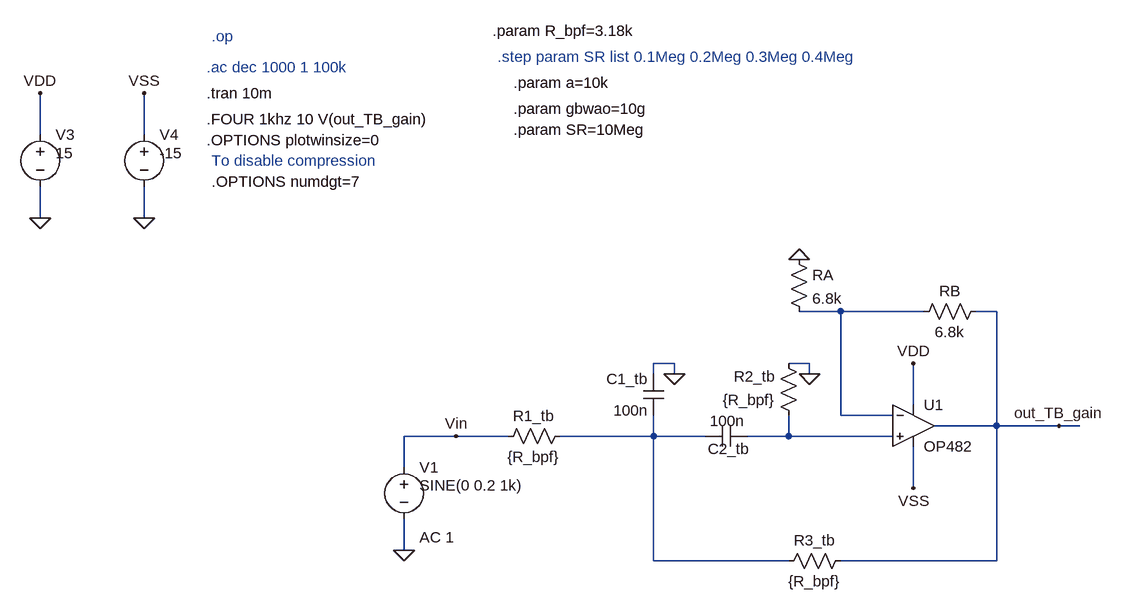
[diagram p0: schematic Etaj 2 - FTB.asc]
Etaj 2 - FTB.asc, the LTspice schematic file:
Version 4.1
SHEET 1 2932 1708
WIRE 1088 -16 1088 -80
WIRE 1248 -16 1248 -80
WIRE 1088 112 1088 64
WIRE 1248 112 1248 64
WIRE 2320 256 2256 256
WIRE 2448 256 2320 256
WIRE 2560 256 2528 256
WIRE 2064 336 2032 336
WIRE 2272 336 2240 336
WIRE 2032 352 2032 336
WIRE 2064 352 2064 336
WIRE 2272 352 2272 336
WIRE 2432 400 2432 336
WIRE 2320 416 2320 256
WIRE 2400 416 2320 416
WIRE 2560 432 2560 256
WIRE 2560 432 2464 432
WIRE 2656 432 2560 432
WIRE 2688 432 2656 432
WIRE 1728 448 1648 448
WIRE 1808 448 1728 448
WIRE 2032 448 2032 416
WIRE 2032 448 1888 448
WIRE 2112 448 2032 448
WIRE 2240 448 2240 416
WIRE 2240 448 2176 448
WIRE 2400 448 2240 448
WIRE 1648 496 1648 448
WIRE 2432 528 2432 464
WIRE 1648 624 1648 576
WIRE 2032 640 2032 448
WIRE 2240 640 2032 640
WIRE 2560 640 2560 432
WIRE 2560 640 2320 640
FLAG 1088 112 0
FLAG 1248 112 0
FLAG 1088 -80 VDD
FLAG 1248 -80 VSS
FLAG 1648 624 0
FLAG 2656 432 out_TB_gain
FLAG 2432 528 VSS
FLAG 2432 336 VDD
FLAG 1728 448 Vin
FLAG 2064 352 0
FLAG 2256 176 0
FLAG 2272 352 0
DATAFLAG 2528 432 ""
SYMBOL voltage 1088 -32 R0
WINDOW 123 24 124 Left 2
WINDOW 39 0 0 Left 2
WINDOW 3 24 44 Left 2
SYMATTR Value 15
SYMATTR InstName V3
SYMBOL voltage 1248 -32 R0
WINDOW 123 24 124 Left 2
WINDOW 39 0 0 Left 2
WINDOW 3 24 44 Left 2
SYMATTR Value -15
SYMATTR InstName V4
SYMBOL voltage 1648 480 R0
WINDOW 123 24 124 Left 2
WINDOW 39 0 0 Left 2
WINDOW 3 24 44 Left 2
SYMATTR Value2 AC 1
SYMATTR Value SINE(0 0.2 1k)
SYMATTR InstName V1
SYMBOL cap 2048 352 M0
SYMATTR InstName C1_tb
SYMATTR Value 100n
SYMBOL res 1904 432 R90
WINDOW 0 0 56 VBottom 2
WINDOW 3 32 56 VTop 2
SYMATTR InstName R1_tb
SYMATTR Value {R_bpf}
SYMBOL res 2256 432 R180
WINDOW 0 36 76 Left 2
WINDOW 3 36 40 Left 2
SYMATTR InstName R2_tb
SYMATTR Value {R_bpf}
SYMBOL cap 2112 464 R270
WINDOW 0 -19 36 VTop 2
WINDOW 3 55 34 VBottom 2
SYMATTR InstName C2_tb
SYMATTR Value 100n
SYMBOL res 2336 624 R90
WINDOW 0 0 56 VBottom 2
WINDOW 3 32 56 VTop 2
SYMATTR InstName R3_tb
SYMATTR Value {R_bpf}
SYMBOL res 2544 240 R90
WINDOW 0 0 56 VBottom 2
WINDOW 3 32 56 VTop 2
SYMATTR InstName RB
SYMATTR Value 6.8k
SYMBOL res 2240 160 R0
SYMATTR InstName RA
SYMATTR Value 6.8k
SYMBOL OpAmps\\OP482 2432 368 R0
SYMATTR InstName U1
TEXT 1344 -120 Left 2 ;.ac dec 1000 1 100k
TEXT 1352 -168 Left 2 ;.op
TEXT 1344 -80 Left 2 !.tran 10m
TEXT 1816 -96 Left 2 !.param a=10k
TEXT 1816 -56 Left 2 !.param gbwao=10g
TEXT 1816 -24 Left 2 !.param SR=10Meg
TEXT 1344 -40 Left 2 !.FOUR 1khz 10 V(out_TB_gain)
TEXT 1344 -8 Left 2 !.OPTIONS plotwinsize=0
TEXT 1352 24 Left 2 ;To disable compression
TEXT 1352 56 Left 2 !.OPTIONS numdgt=7
TEXT 1792 -136 Left 2 ;.step param SR list 0.1Meg 0.2Meg 0.3Meg 0.4Meg
TEXT 1784 -176 Left 2 !.param R_bpf=3.18k

The netlist it stands for:
* Etaj 2 - FTB.asc
V3 VDD 0 15
V4 VSS 0 -15
V1 Vin 0 SINE(0 0.2 1k) AC 1
C1_tb 0 N002 100n
R1_tb N002 Vin {R_bpf}
R2_tb N003 0 {R_bpf}
C2_tb N002 N003 100n
R3_tb out_TB_gain N002 {R_bpf}
RB out_TB_gain N001 6.8k
RA 0 N001 6.8k
X§U1 N003 N001 VDD VSS out_TB_gain OP482  ; pins In+ In- V+ V- OUT
* .ac dec 1000 1 100k
* .op
.tran 10m
.param a=10k
.param gbwao=10g
.param SR=10Meg
.FOUR 1khz 10 V(out_TB_gain)
.OPTIONS plotwinsize=0
* To disable compression
.OPTIONS numdgt=7
* .step param SR list 0.1Meg 0.2Meg 0.3Meg 0.4Meg
.param R_bpf=3.18k
.backanno
.end